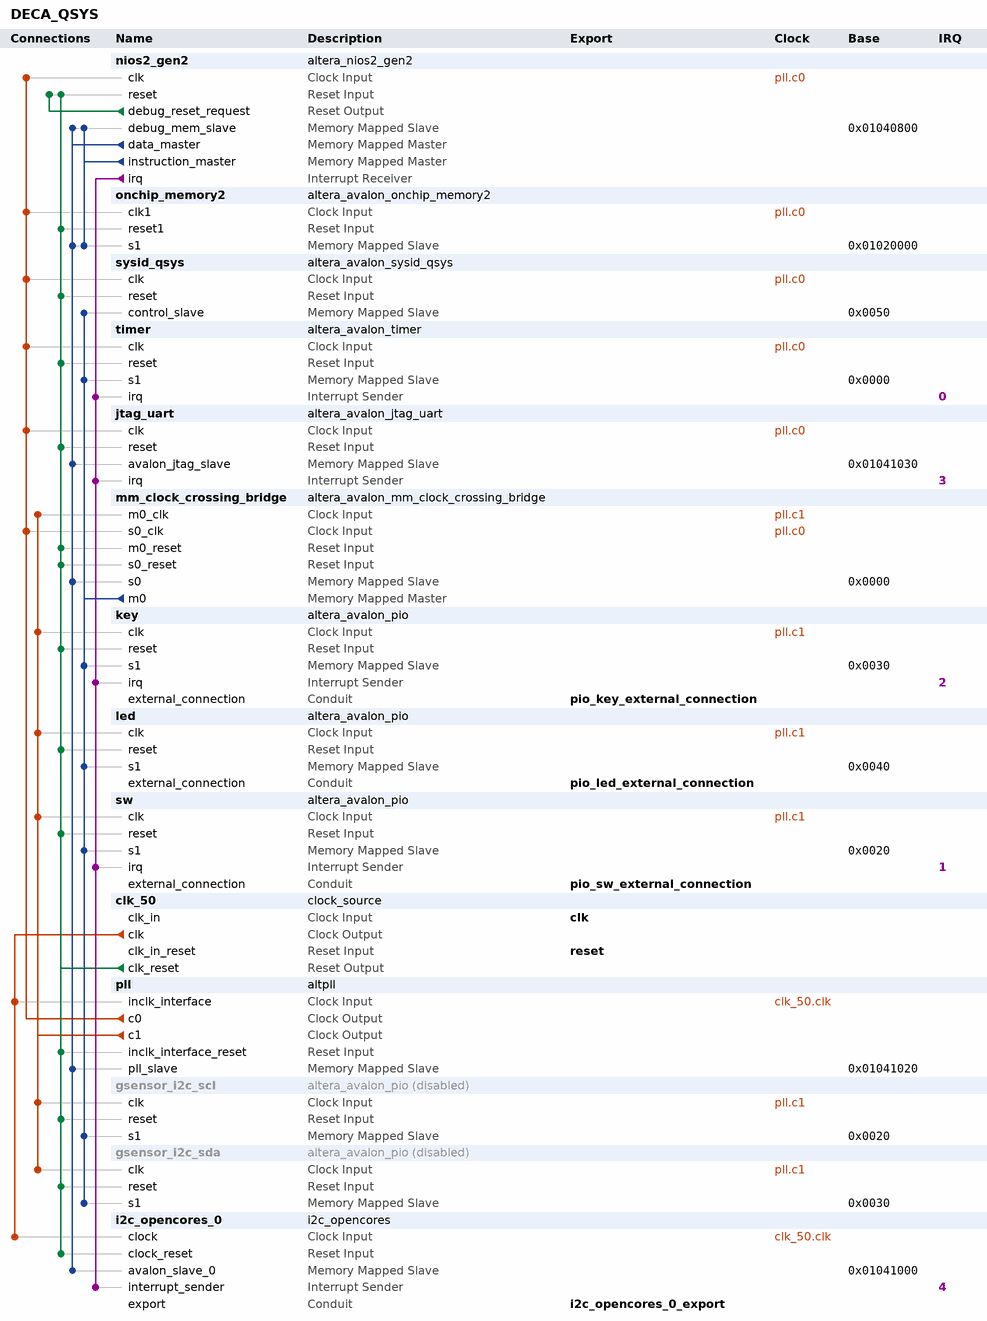
[diagram p0: system contents]
# Platform Designer (Qsys) system DECA_QSYS, MAX 10 10M50DAF484C6GES
# Parameters at their usual value, and those the tool derives, are not listed.
package require -exact qsys 15.0
create_system DECA_QSYS
set_project_property DEVICE_FAMILY {MAX 10}
set_project_property DEVICE 10M50DAF484C6GES

add_instance nios2_gen2 altera_nios2_gen2 15.0
set_instance_parameter_value nios2_gen2 dcache_size 2048
set_instance_parameter_value nios2_gen2 exceptionSlave onchip_memory2.s1
set_instance_parameter_value nios2_gen2 icache_size 4096
set_instance_parameter_value nios2_gen2 impl Fast
set_instance_parameter_value nios2_gen2 resetSlave onchip_memory2.s1

add_instance onchip_memory2 altera_avalon_onchip_memory2 15.0
set_instance_parameter_value onchip_memory2 dataWidth 32
set_instance_parameter_value onchip_memory2 dualPort false
set_instance_parameter_value onchip_memory2 initMemContent false
set_instance_parameter_value onchip_memory2 initializationFileName onchip_mem.hex
set_instance_parameter_value onchip_memory2 memorySize 120000

add_instance sysid_qsys altera_avalon_sysid_qsys 15.0
set_instance_parameter_value sysid_qsys id 0

add_instance timer altera_avalon_timer 15.0
set_instance_parameter_value timer period 1
set_instance_parameter_value timer periodUnits MSEC

add_instance jtag_uart altera_avalon_jtag_uart 15.0
set_instance_parameter_value jtag_uart simInteractiveOptions NO_INTERACTIVE_WINDOWS

add_instance mm_clock_crossing_bridge altera_avalon_mm_clock_crossing_bridge 15.0
set_instance_parameter_value mm_clock_crossing_bridge ADDRESS_WIDTH 10
set_instance_parameter_value mm_clock_crossing_bridge COMMAND_FIFO_DEPTH 4
set_instance_parameter_value mm_clock_crossing_bridge DATA_WIDTH 32
set_instance_parameter_value mm_clock_crossing_bridge MASTER_SYNC_DEPTH 2
set_instance_parameter_value mm_clock_crossing_bridge MAX_BURST_SIZE 1
set_instance_parameter_value mm_clock_crossing_bridge RESPONSE_FIFO_DEPTH 4
set_instance_parameter_value mm_clock_crossing_bridge SLAVE_SYNC_DEPTH 2
set_instance_parameter_value mm_clock_crossing_bridge USE_AUTO_ADDRESS_WIDTH 0

add_instance key altera_avalon_pio 15.0
set_instance_parameter_value key captureEdge true
set_instance_parameter_value key direction Input
set_instance_parameter_value key edgeType FALLING
set_instance_parameter_value key generateIRQ true
set_instance_parameter_value key irqType EDGE
set_instance_parameter_value key width 2

add_instance led altera_avalon_pio 15.0
set_instance_parameter_value led direction Output
set_instance_parameter_value led width 8

add_instance sw altera_avalon_pio 15.0
set_instance_parameter_value sw captureEdge true
set_instance_parameter_value sw direction Input
set_instance_parameter_value sw edgeType ANY
set_instance_parameter_value sw generateIRQ true
set_instance_parameter_value sw irqType EDGE
set_instance_parameter_value sw width 2

add_instance clk_50 clock_source 15.0
set_instance_parameter_value clk_50 clockFrequency 50000000

add_instance pll altpll 15.0
set_instance_parameter_value pll CLK0_DIVIDE_BY 1
set_instance_parameter_value pll CLK0_MULTIPLY_BY 2
set_instance_parameter_value pll CLK1_DIVIDE_BY 5
set_instance_parameter_value pll CLK1_DUTY_CYCLE 50
set_instance_parameter_value pll CLK1_MULTIPLY_BY 1
set_instance_parameter_value pll CLK1_PHASE_SHIFT 0
set_instance_parameter_value pll INCLK0_INPUT_FREQUENCY 20000
set_instance_parameter_value pll PORT_ARESET PORT_UNUSED
set_instance_parameter_value pll PORT_LOCKED PORT_UNUSED
set_instance_parameter_value pll PORT_clk1 PORT_USED
set_instance_parameter_value pll PORT_clk2 PORT_UNUSED
set_instance_parameter_value pll PORT_clk3 PORT_UNUSED

add_instance gsensor_i2c_scl altera_avalon_pio 15.0
set_instance_property gsensor_i2c_scl ENABLED false
set_instance_parameter_value gsensor_i2c_scl direction Output
set_instance_parameter_value gsensor_i2c_scl width 1

add_instance gsensor_i2c_sda altera_avalon_pio 15.0
set_instance_property gsensor_i2c_sda ENABLED false
set_instance_parameter_value gsensor_i2c_sda direction Bidir
set_instance_parameter_value gsensor_i2c_sda width 1

add_instance i2c_opencores_0 i2c_opencores 12.0

# connections
add_connection clk_50.clk i2c_opencores_0.clock clock
add_connection clk_50.clk pll.inclk_interface clock
add_connection pll.c0 jtag_uart.clk clock
add_connection pll.c0 mm_clock_crossing_bridge.s0_clk clock
add_connection pll.c0 nios2_gen2.clk clock
add_connection pll.c0 onchip_memory2.clk1 clock
add_connection pll.c0 sysid_qsys.clk clock
add_connection pll.c0 timer.clk clock
add_connection pll.c1 gsensor_i2c_scl.clk clock
add_connection pll.c1 gsensor_i2c_sda.clk clock
add_connection pll.c1 key.clk clock
add_connection pll.c1 led.clk clock
add_connection pll.c1 mm_clock_crossing_bridge.m0_clk clock
add_connection pll.c1 sw.clk clock
add_connection clk_50.clk_reset gsensor_i2c_scl.reset reset
add_connection clk_50.clk_reset gsensor_i2c_sda.reset reset
add_connection clk_50.clk_reset i2c_opencores_0.clock_reset reset
add_connection clk_50.clk_reset jtag_uart.reset reset
add_connection clk_50.clk_reset key.reset reset
add_connection clk_50.clk_reset led.reset reset
add_connection clk_50.clk_reset mm_clock_crossing_bridge.m0_reset reset
add_connection clk_50.clk_reset mm_clock_crossing_bridge.s0_reset reset
add_connection clk_50.clk_reset nios2_gen2.reset reset
add_connection clk_50.clk_reset onchip_memory2.reset1 reset
add_connection clk_50.clk_reset pll.inclk_interface_reset reset
add_connection clk_50.clk_reset sw.reset reset
add_connection clk_50.clk_reset sysid_qsys.reset reset
add_connection clk_50.clk_reset timer.reset reset
add_connection nios2_gen2.debug_reset_request nios2_gen2.reset reset
add_connection mm_clock_crossing_bridge.m0 gsensor_i2c_scl.s1 avalon
set_connection_parameter_value mm_clock_crossing_bridge.m0/gsensor_i2c_scl.s1 baseAddress 0x0020
add_connection mm_clock_crossing_bridge.m0 gsensor_i2c_sda.s1 avalon
set_connection_parameter_value mm_clock_crossing_bridge.m0/gsensor_i2c_sda.s1 baseAddress 0x0030
add_connection mm_clock_crossing_bridge.m0 key.s1 avalon
set_connection_parameter_value mm_clock_crossing_bridge.m0/key.s1 baseAddress 0x0030
add_connection mm_clock_crossing_bridge.m0 led.s1 avalon
set_connection_parameter_value mm_clock_crossing_bridge.m0/led.s1 baseAddress 0x0040
add_connection mm_clock_crossing_bridge.m0 sw.s1 avalon
set_connection_parameter_value mm_clock_crossing_bridge.m0/sw.s1 baseAddress 0x0020
add_connection mm_clock_crossing_bridge.m0 sysid_qsys.control_slave avalon
set_connection_parameter_value mm_clock_crossing_bridge.m0/sysid_qsys.control_slave baseAddress 0x0050
add_connection mm_clock_crossing_bridge.m0 timer.s1 avalon
set_connection_parameter_value mm_clock_crossing_bridge.m0/timer.s1 baseAddress 0x0000
add_connection nios2_gen2.data_master i2c_opencores_0.avalon_slave_0 avalon
set_connection_parameter_value nios2_gen2.data_master/i2c_opencores_0.avalon_slave_0 baseAddress 0x01041000
add_connection nios2_gen2.data_master jtag_uart.avalon_jtag_slave avalon
set_connection_parameter_value nios2_gen2.data_master/jtag_uart.avalon_jtag_slave baseAddress 0x01041030
add_connection nios2_gen2.data_master mm_clock_crossing_bridge.s0 avalon
set_connection_parameter_value nios2_gen2.data_master/mm_clock_crossing_bridge.s0 baseAddress 0x0000
add_connection nios2_gen2.data_master nios2_gen2.debug_mem_slave avalon
set_connection_parameter_value nios2_gen2.data_master/nios2_gen2.debug_mem_slave baseAddress 0x01040800
add_connection nios2_gen2.data_master onchip_memory2.s1 avalon
set_connection_parameter_value nios2_gen2.data_master/onchip_memory2.s1 baseAddress 0x01020000
add_connection nios2_gen2.data_master pll.pll_slave avalon
set_connection_parameter_value nios2_gen2.data_master/pll.pll_slave baseAddress 0x01041020
add_connection nios2_gen2.instruction_master nios2_gen2.debug_mem_slave avalon
set_connection_parameter_value nios2_gen2.instruction_master/nios2_gen2.debug_mem_slave baseAddress 0x01040800
add_connection nios2_gen2.instruction_master onchip_memory2.s1 avalon
set_connection_parameter_value nios2_gen2.instruction_master/onchip_memory2.s1 baseAddress 0x01020000
add_connection nios2_gen2.irq i2c_opencores_0.interrupt_sender interrupt
set_connection_parameter_value nios2_gen2.irq/i2c_opencores_0.interrupt_sender irqNumber 4
add_connection nios2_gen2.irq jtag_uart.irq interrupt
set_connection_parameter_value nios2_gen2.irq/jtag_uart.irq irqNumber 3
add_connection nios2_gen2.irq key.irq interrupt
set_connection_parameter_value nios2_gen2.irq/key.irq irqNumber 2
add_connection nios2_gen2.irq sw.irq interrupt
set_connection_parameter_value nios2_gen2.irq/sw.irq irqNumber 1
add_connection nios2_gen2.irq timer.irq interrupt
set_connection_parameter_value nios2_gen2.irq/timer.irq irqNumber 0

# exported interfaces
add_interface clk clock sink
set_interface_property clk EXPORT_OF clk_50.clk_in
add_interface i2c_opencores_0_export conduit end
set_interface_property i2c_opencores_0_export EXPORT_OF i2c_opencores_0.export
add_interface pio_key_external_connection conduit end
set_interface_property pio_key_external_connection EXPORT_OF key.external_connection
add_interface pio_led_external_connection conduit end
set_interface_property pio_led_external_connection EXPORT_OF led.external_connection
add_interface pio_sw_external_connection conduit end
set_interface_property pio_sw_external_connection EXPORT_OF sw.external_connection
add_interface reset reset sink
set_interface_property reset EXPORT_OF clk_50.clk_in_reset

set_interconnect_requirement {$system} qsys_mm.clockCrossingAdapter HANDSHAKE
set_interconnect_requirement {$system} qsys_mm.insertDefaultSlave FALSE
set_interconnect_requirement {$system} qsys_mm.maxAdditionalLatency 1

save_system DECA_QSYS.qsys
